# Altium schematic sheet BeagleBoneBlackPowerMeterCap.SchDoc: PowerMeterCapForBeagleBone
size A4; Date: 22.06.2020; CompanyName: -; DrawnBy: Baris; DocumentNumber: 69; Revision: 1.1; SheetNumber: 1; SheetTotal: 1; CurrentTime: 22.06.2020
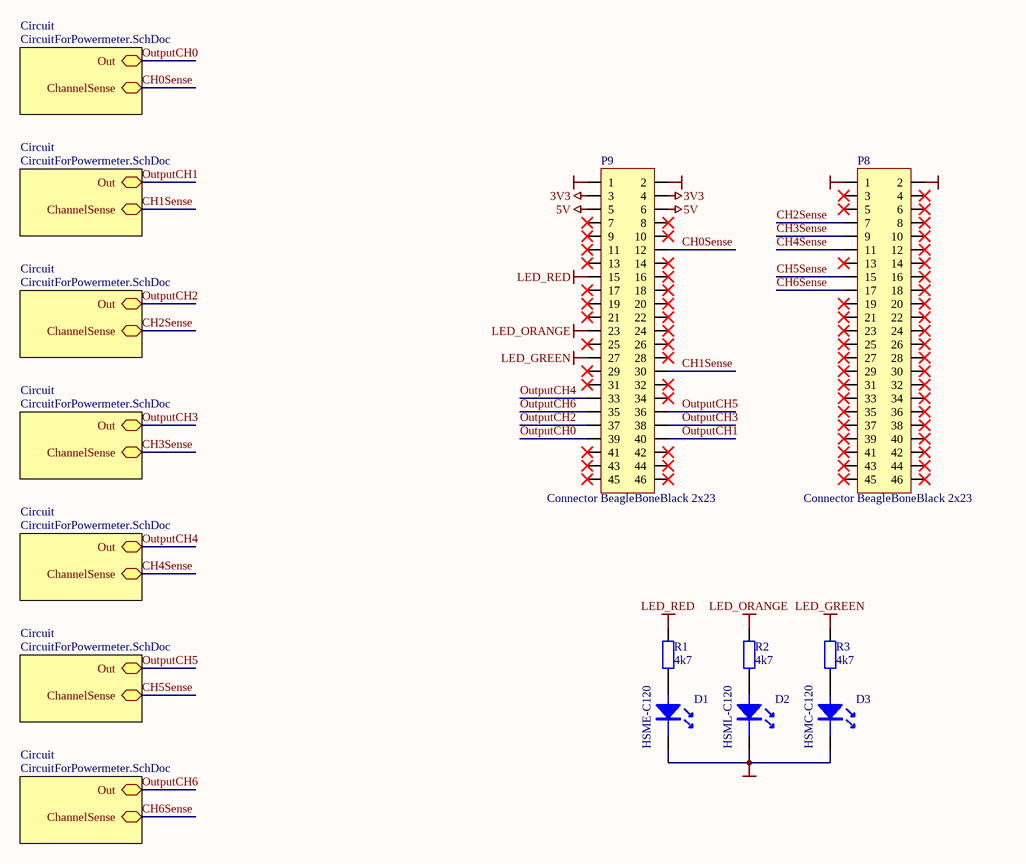
[diagram p0: BeagleBoneBlackPowerMeterCap.SchDoc]

## Parts
D1  HSME-C120  [AVAGO_HSMx-C120]
D2  HSML-C120  [AVAGO_HSMx-C120]
D3  HSMC-C120  [AVAGO_HSMx-C120]
P8  Connector BeagleBoneBlack 2x23  [Connector_BeagleBoneBlack_2x23]
P9  Connector BeagleBoneBlack 2x23  [Connector_BeagleBoneBlack_2x23]
R1  4k7  [0805_R]
R2  4k7  [0805_R]
R3  4k7  [0805_R]

## Sub-sheets
Circuit = CircuitForPowermeter.SchDoc: Out, ChannelSense
Circuit = CircuitForPowermeter.SchDoc: Out, ChannelSense
Circuit = CircuitForPowermeter.SchDoc: Out, ChannelSense
Circuit = CircuitForPowermeter.SchDoc: Out, ChannelSense
Circuit = CircuitForPowermeter.SchDoc: Out, ChannelSense
Circuit = CircuitForPowermeter.SchDoc: Out, ChannelSense
Circuit = CircuitForPowermeter.SchDoc: Out, ChannelSense

## Nets
3V3: P9.3 P9.4
5V: P9.5 P9.6
LED_GREEN: P9.27 R3.2
LED_ORANGE: P9.23 R2.2
LED_RED: P9.15 R1.2
NetD1_C: D1.C D2.C D3.C P8.1 P8.2 P9.1 P9.2
CH0Sense: P9.12 ; sheet Circuit/ChannelSense
CH1Sense: P9.30 ; sheet Circuit/ChannelSense
CH2Sense: P8.7 ; sheet Circuit/ChannelSense
CH3Sense: P8.9 ; sheet Circuit/ChannelSense
CH4Sense: P8.11 ; sheet Circuit/ChannelSense
CH5Sense: P8.15 ; sheet Circuit/ChannelSense
CH6Sense: P8.17 ; sheet Circuit/ChannelSense
OutputCH0: P9.39 ; sheet Circuit/Out
OutputCH1: P9.40 ; sheet Circuit/Out
OutputCH2: P9.37 ; sheet Circuit/Out
OutputCH3: P9.38 ; sheet Circuit/Out
OutputCH4: P9.33 ; sheet Circuit/Out
OutputCH5: P9.36 ; sheet Circuit/Out
OutputCH6: P9.35 ; sheet Circuit/Out
NetD1_A: D1.A R1.1
NetD2_A: D2.A R2.1
NetD3_A: D3.A R3.1

Not connected (* = marked no-connect by the designer): P8 3* 4* 5* 6* 8* 10* 12* 13* 14* 16* 18* 19* 20* 21* 22* 23* 24* 25* 26* 27* 28* 29* 30* 31* 32* 33* 34* 35* 36* 37* 38* 39* 40* 41* 42* 43* 44* 45* 46*; P9 7* 8* 9* 10* 11* 13* 14* 16* 17* 18* 19* 20* 21* 22* 24* 25* 26* 28* 29* 31* 32* 34* 41* 42* 43* 44* 45* 46*

## Notes on the sheet
- Title:
- Number:
- Drawn by:
- Revision:
- Date:
- Sheet
- of
- File:

## Library data of the parts
D1 = HSME-C120: LED right angle green; Hersteller: BROADCOM; Art-Nummer: P300 326; Bestell-Bezeichnung: HSME-C120
D2 = HSML-C120: LED right angle orange; Hersteller: BROADCOM; Art-Nummer: P300 325; Bestell-Bezeichnung: HSML-C120
D3 = HSMC-C120: LED right angle red; Hersteller: BROADCOM; Art-Nummer: P300 324; Bestell-Bezeichnung: HSMC-C120
P8 P9 = J_Connector_BeagleBoneBlack_2x23: 23pin dual row header
R1-R3 = R: Resistor; Value: 4k7; Power Rating: *; Tolerance: *; Manufacturer 1: *; Manufacturer 1 Part No.: *; Distributor 1: *; Distributor 1 Part No.: *